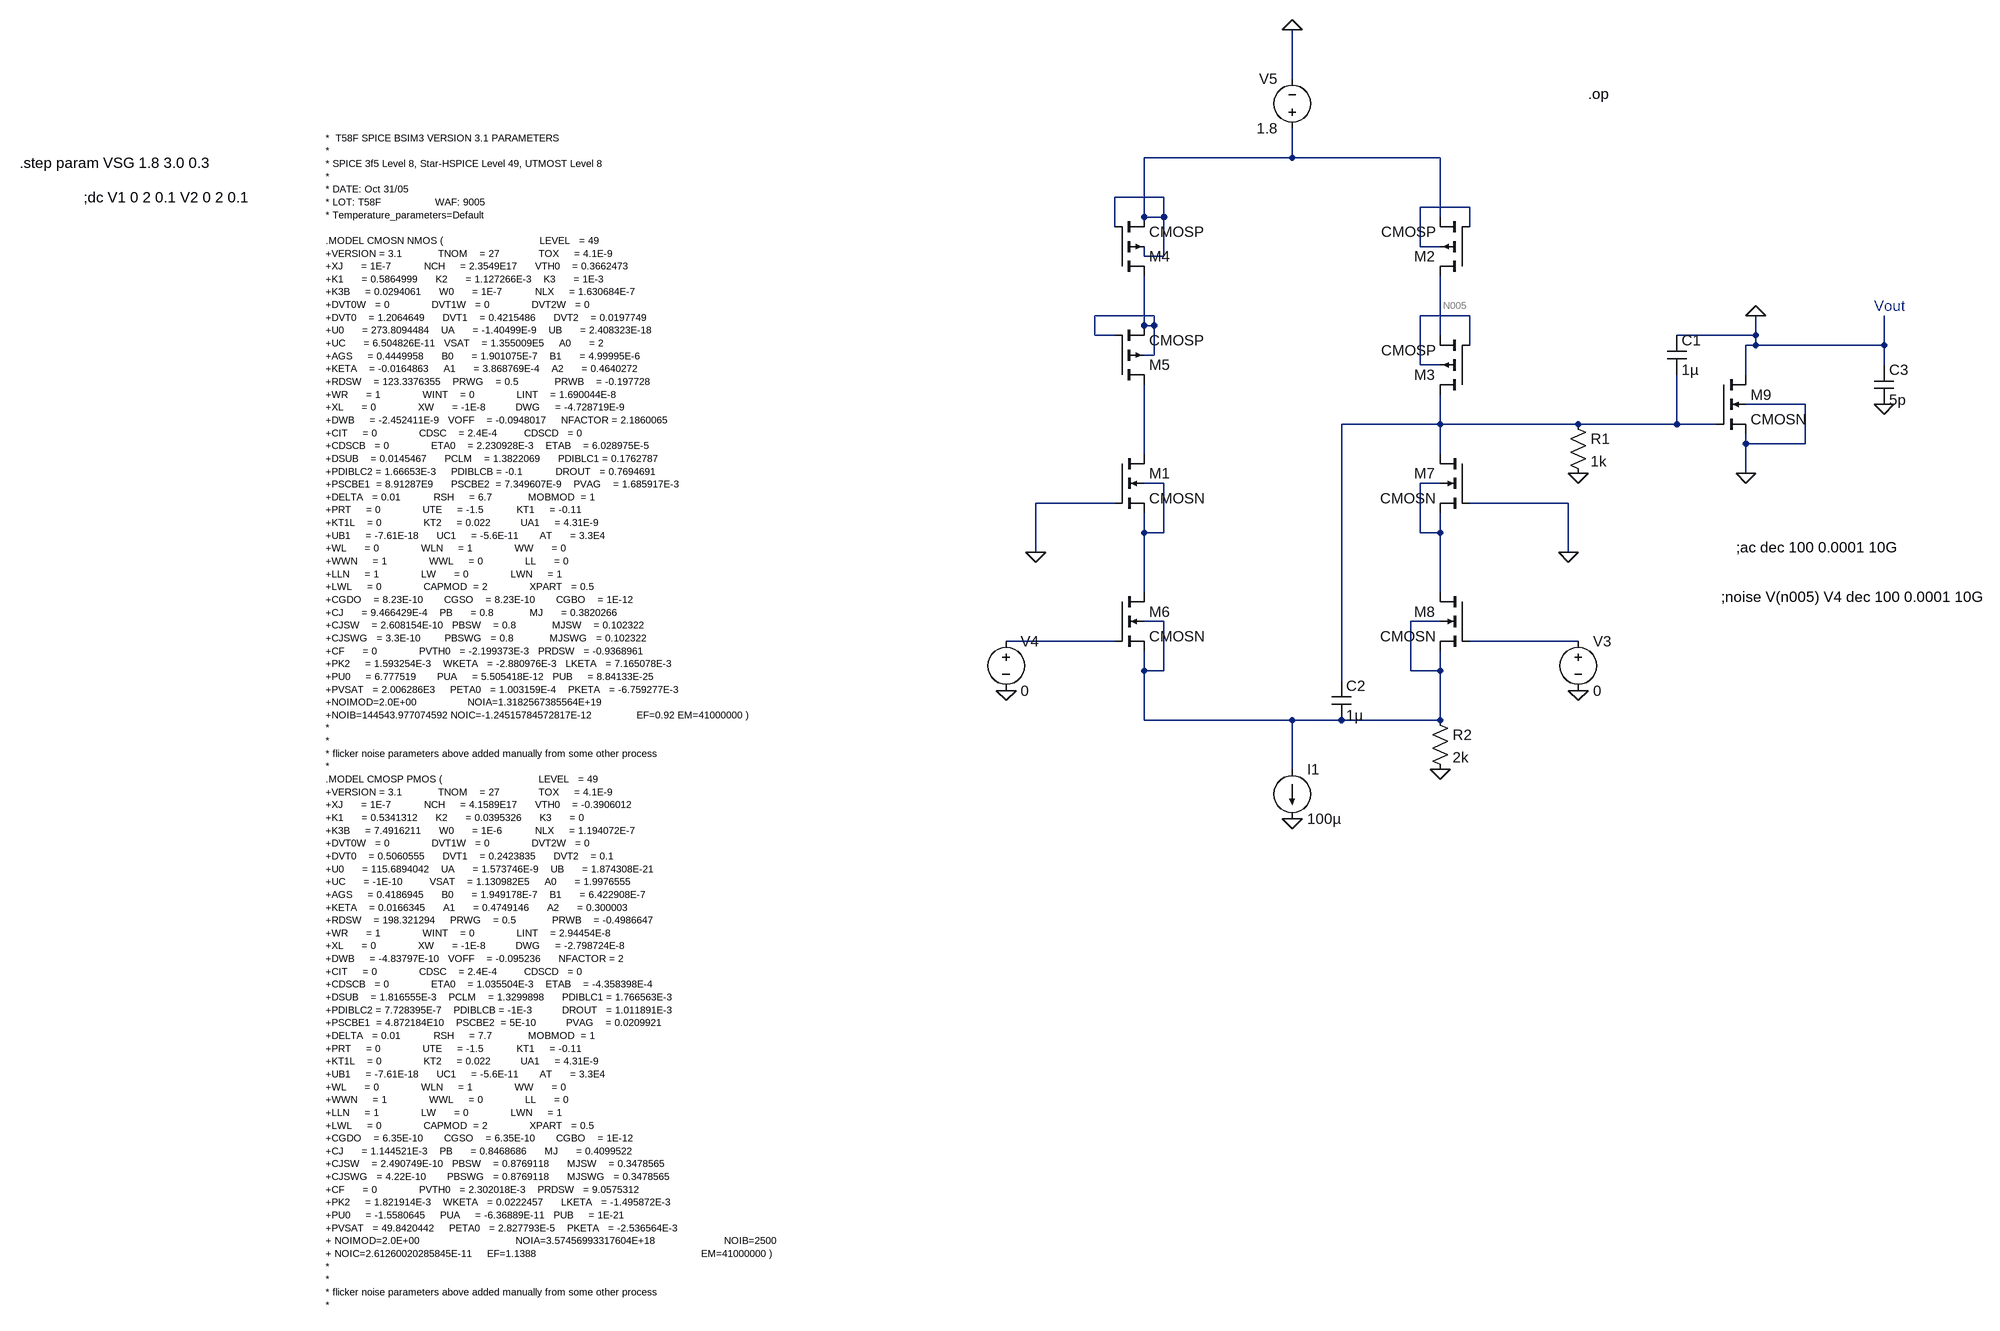
[diagram p0: schematic Project.asc]
Project.asc, the LTspice schematic file:
Version 4
SHEET 1 3716 956
WIRE 2288 -880 2288 -960
WIRE 2288 -752 2288 -800
WIRE 2288 -752 2048 -752
WIRE 2528 -752 2288 -752
WIRE 2080 -688 2000 -688
WIRE 2576 -672 2496 -672
WIRE 2048 -656 2048 -752
WIRE 2080 -656 2080 -688
WIRE 2080 -656 2048 -656
WIRE 2528 -656 2528 -752
WIRE 2000 -640 2000 -688
WIRE 2576 -640 2576 -672
WIRE 2496 -608 2496 -672
WIRE 2528 -608 2496 -608
WIRE 2048 -592 2048 -608
WIRE 2080 -592 2080 -656
WIRE 2080 -592 2048 -592
WIRE 2064 -496 1968 -496
WIRE 2576 -496 2496 -496
WIRE 2048 -480 2048 -560
WIRE 2064 -480 2064 -496
WIRE 2064 -480 2048 -480
WIRE 1968 -464 1968 -496
WIRE 2000 -464 1968 -464
WIRE 2528 -464 2528 -560
WIRE 3040 -464 3040 -496
WIRE 3040 -464 2912 -464
WIRE 2576 -448 2576 -496
WIRE 3040 -448 3040 -464
WIRE 3040 -448 3024 -448
WIRE 3248 -448 3248 -496
WIRE 3248 -448 3040 -448
WIRE 2064 -432 2064 -480
WIRE 2064 -432 2048 -432
WIRE 2496 -416 2496 -496
WIRE 2528 -416 2496 -416
WIRE 3248 -416 3248 -448
WIRE 3024 -400 3024 -448
WIRE 3120 -352 3024 -352
WIRE 2528 -320 2528 -368
WIRE 2528 -320 2368 -320
WIRE 2752 -320 2528 -320
WIRE 2912 -320 2912 -400
WIRE 2912 -320 2752 -320
WIRE 2976 -320 2912 -320
WIRE 3024 -288 3024 -304
WIRE 3120 -288 3120 -352
WIRE 3120 -288 3024 -288
WIRE 2048 -272 2048 -384
WIRE 2528 -272 2528 -320
WIRE 3024 -240 3024 -288
WIRE 2080 -224 2048 -224
WIRE 2528 -224 2496 -224
WIRE 2000 -192 1872 -192
WIRE 2736 -192 2576 -192
WIRE 2048 -144 2048 -176
WIRE 2080 -144 2080 -224
WIRE 2080 -144 2048 -144
WIRE 2496 -144 2496 -224
WIRE 2528 -144 2528 -176
WIRE 2528 -144 2496 -144
WIRE 1872 -112 1872 -192
WIRE 2736 -112 2736 -192
WIRE 2048 -48 2048 -144
WIRE 2528 -48 2528 -144
WIRE 2080 0 2048 0
WIRE 2528 0 2480 0
WIRE 2000 32 1824 32
WIRE 2752 32 2576 32
WIRE 2048 80 2048 48
WIRE 2080 80 2080 0
WIRE 2080 80 2048 80
WIRE 2480 80 2480 0
WIRE 2528 80 2528 48
WIRE 2528 80 2480 80
WIRE 2368 96 2368 -320
WIRE 2048 160 2048 80
WIRE 2288 160 2048 160
WIRE 2368 160 2288 160
WIRE 2528 160 2528 80
WIRE 2528 160 2368 160
WIRE 2288 240 2288 160
FLAG 2288 320 0
FLAG 1872 -112 0
FLAG 2736 -112 0
FLAG 1824 112 0
FLAG 2752 112 0
FLAG 2288 -960 0
FLAG 3024 -240 0
FLAG 3248 -352 0
FLAG 2528 240 0
FLAG 3040 -496 0
FLAG 2752 -240 0
SYMBOL pmos4 2576 -560 R180
SYMATTR InstName M2
SYMATTR Value CMOSP
SYMATTR Value2 l=0.5u w=20u
SYMBOL pmos4 2576 -368 R180
SYMATTR InstName M3
SYMATTR Value CMOSP
SYMATTR Value2 l=0.5u w=20u
SYMBOL pmos4 2000 -560 M180
SYMATTR InstName M4
SYMATTR Value CMOSP
SYMATTR Value2 l=0.5u w=20u
SYMBOL pmos4 2000 -384 M180
SYMATTR InstName M5
SYMATTR Value CMOSP
SYMATTR Value2 l=0.5u w=20u
SYMBOL nmos4 2000 -272 R0
SYMATTR InstName M1
SYMATTR Value CMOSN
SYMATTR Value2 l=0.05u w=20u
SYMBOL nmos4 2000 -48 R0
SYMATTR InstName M6
SYMATTR Value CMOSN
SYMATTR Value2 l=0.05u w=20u
SYMBOL nmos4 2576 -272 M0
SYMATTR InstName M7
SYMATTR Value CMOSN
SYMATTR Value2 l=0.05u w=20u
SYMBOL nmos4 2576 -48 M0
SYMATTR InstName M8
SYMATTR Value CMOSN
SYMATTR Value2 l=0.05u w=20u
SYMBOL current 2288 240 R0
WINDOW 123 0 0 Left 0
WINDOW 39 0 0 Left 0
SYMATTR InstName I1
SYMATTR Value 100µ
SYMBOL voltage 2752 16 R0
WINDOW 39 0 0 Left 0
SYMATTR Value2 AC 0.0001 -180
SYMATTR InstName V3
SYMATTR Value 0
SYMBOL voltage 1824 16 R0
WINDOW 39 0 0 Left 0
SYMATTR Value2 AC 0.0001
SYMATTR InstName V4
SYMATTR Value 0
SYMBOL voltage 2288 -784 R180
WINDOW 0 24 96 Left 2
WINDOW 3 24 16 Left 2
WINDOW 123 0 0 Left 0
WINDOW 39 0 0 Left 0
SYMATTR InstName V5
SYMATTR Value 1.8
SYMBOL nmos4 2976 -400 R0
SYMATTR InstName M9
SYMATTR Value CMOSN
SYMATTR Value2 l=0.05u w=15u
SYMBOL cap 3232 -416 R0
SYMATTR InstName C3
SYMATTR Value 5p
SYMBOL cap 2896 -464 R0
SYMATTR InstName C1
SYMATTR Value 1µ
SYMBOL res 2512 144 R0
SYMATTR InstName R2
SYMATTR Value 2k
SYMBOL res 2736 -336 R0
SYMATTR InstName R1
SYMATTR Value 1k
SYMBOL cap 2352 96 R0
SYMATTR InstName C2
SYMATTR Value 1µ
TEXT 720 -784 Left 1 !*  T58F SPICE BSIM3 VERSION 3.1 PARAMETERS\n* \n* SPICE 3f5 Level 8, Star-HSPICE Level 49, UTMOST Level 8\n* \n* DATE: Oct 31/05\n* LOT: T58F                  WAF: 9005\n* Temperature_parameters=Default\n \n.MODEL CMOSN NMOS (                                LEVEL   = 49\n+VERSION = 3.1            TNOM    = 27             TOX     = 4.1E-9\n+XJ      = 1E-7           NCH     = 2.3549E17      VTH0    = 0.3662473\n+K1      = 0.5864999      K2      = 1.127266E-3    K3      = 1E-3\n+K3B     = 0.0294061      W0      = 1E-7           NLX     = 1.630684E-7\n+DVT0W   = 0              DVT1W   = 0              DVT2W   = 0\n+DVT0    = 1.2064649      DVT1    = 0.4215486      DVT2    = 0.0197749\n+U0      = 273.8094484    UA      = -1.40499E-9    UB      = 2.408323E-18\n+UC      = 6.504826E-11   VSAT    = 1.355009E5     A0      = 2\n+AGS     = 0.4449958      B0      = 1.901075E-7    B1      = 4.99995E-6\n+KETA    = -0.0164863     A1      = 3.868769E-4    A2      = 0.4640272\n+RDSW    = 123.3376355    PRWG    = 0.5            PRWB    = -0.197728\n+WR      = 1              WINT    = 0              LINT    = 1.690044E-8\n+XL      = 0              XW      = -1E-8          DWG     = -4.728719E-9\n+DWB     = -2.452411E-9   VOFF    = -0.0948017     NFACTOR = 2.1860065\n+CIT     = 0              CDSC    = 2.4E-4         CDSCD   = 0\n+CDSCB   = 0              ETA0    = 2.230928E-3    ETAB    = 6.028975E-5\n+DSUB    = 0.0145467      PCLM    = 1.3822069      PDIBLC1 = 0.1762787\n+PDIBLC2 = 1.66653E-3     PDIBLCB = -0.1           DROUT   = 0.7694691\n+PSCBE1  = 8.91287E9      PSCBE2  = 7.349607E-9    PVAG    = 1.685917E-3\n+DELTA   = 0.01           RSH     = 6.7            MOBMOD  = 1\n+PRT     = 0              UTE     = -1.5           KT1     = -0.11\n+KT1L    = 0              KT2     = 0.022          UA1     = 4.31E-9\n+UB1     = -7.61E-18      UC1     = -5.6E-11       AT      = 3.3E4\n+WL      = 0              WLN     = 1              WW      = 0\n+WWN     = 1              WWL     = 0              LL      = 0\n+LLN     = 1              LW      = 0              LWN     = 1\n+LWL     = 0              CAPMOD  = 2              XPART   = 0.5\n+CGDO    = 8.23E-10       CGSO    = 8.23E-10       CGBO    = 1E-12\n+CJ      = 9.466429E-4    PB      = 0.8            MJ      = 0.3820266\n+CJSW    = 2.608154E-10   PBSW    = 0.8            MJSW    = 0.102322\n+CJSWG   = 3.3E-10        PBSWG   = 0.8            MJSWG   = 0.102322\n+CF      = 0              PVTH0   = -2.199373E-3   PRDSW   = -0.9368961\n+PK2     = 1.593254E-3    WKETA   = -2.880976E-3   LKETA   = 7.165078E-3\n+PU0     = 6.777519       PUA     = 5.505418E-12   PUB     = 8.84133E-25\n+PVSAT   = 2.006286E3     PETA0   = 1.003159E-4    PKETA   = -6.759277E-3\n+NOIMOD=2.0E+00                 NOIA=1.3182567385564E+19\n+NOIB=144543.977074592 NOIC=-1.24515784572817E-12               EF=0.92 EM=41000000 )\n*\n*\n* flicker noise parameters above added manually from some other process\n* \n.MODEL CMOSP PMOS (                                LEVEL   = 49\n+VERSION = 3.1            TNOM    = 27             TOX     = 4.1E-9\n+XJ      = 1E-7           NCH     = 4.1589E17      VTH0    = -0.3906012\n+K1      = 0.5341312      K2      = 0.0395326      K3      = 0\n+K3B     = 7.4916211      W0      = 1E-6           NLX     = 1.194072E-7\n+DVT0W   = 0              DVT1W   = 0              DVT2W   = 0\n+DVT0    = 0.5060555      DVT1    = 0.2423835      DVT2    = 0.1\n+U0      = 115.6894042    UA      = 1.573746E-9    UB      = 1.874308E-21\n+UC      = -1E-10         VSAT    = 1.130982E5     A0      = 1.9976555\n+AGS     = 0.4186945      B0      = 1.949178E-7    B1      = 6.422908E-7\n+KETA    = 0.0166345      A1      = 0.4749146      A2      = 0.300003\n+RDSW    = 198.321294     PRWG    = 0.5            PRWB    = -0.4986647\n+WR      = 1              WINT    = 0              LINT    = 2.94454E-8\n+XL      = 0              XW      = -1E-8          DWG     = -2.798724E-8\n+DWB     = -4.83797E-10   VOFF    = -0.095236      NFACTOR = 2\n+CIT     = 0              CDSC    = 2.4E-4         CDSCD   = 0\n+CDSCB   = 0              ETA0    = 1.035504E-3    ETAB    = -4.358398E-4\n+DSUB    = 1.816555E-3    PCLM    = 1.3299898      PDIBLC1 = 1.766563E-3\n+PDIBLC2 = 7.728395E-7    PDIBLCB = -1E-3          DROUT   = 1.011891E-3\n+PSCBE1  = 4.872184E10    PSCBE2  = 5E-10          PVAG    = 0.0209921\n+DELTA   = 0.01           RSH     = 7.7            MOBMOD  = 1\n+PRT     = 0              UTE     = -1.5           KT1     = -0.11\n+KT1L    = 0              KT2     = 0.022          UA1     = 4.31E-9\n+UB1     = -7.61E-18      UC1     = -5.6E-11       AT      = 3.3E4\n+WL      = 0              WLN     = 1              WW      = 0\n+WWN     = 1              WWL     = 0              LL      = 0\n+LLN     = 1              LW      = 0              LWN     = 1\n+LWL     = 0              CAPMOD  = 2              XPART   = 0.5\n+CGDO    = 6.35E-10       CGSO    = 6.35E-10       CGBO    = 1E-12\n+CJ      = 1.144521E-3    PB      = 0.8468686      MJ      = 0.4099522\n+CJSW    = 2.490749E-10   PBSW    = 0.8769118      MJSW    = 0.3478565\n+CJSWG   = 4.22E-10       PBSWG   = 0.8769118      MJSWG   = 0.3478565\n+CF      = 0              PVTH0   = 2.302018E-3    PRDSW   = 9.0575312\n+PK2     = 1.821914E-3    WKETA   = 0.0222457      LKETA   = -1.495872E-3\n+PU0     = -1.5580645     PUA     = -6.36889E-11   PUB     = 1E-21\n+PVSAT   = 49.8420442     PETA0   = 2.827793E-5    PKETA   = -2.536564E-3 \n+ NOIMOD=2.0E+00                                NOIA=3.57456993317604E+18                       NOIB=2500\n+ NOIC=2.61260020285845E-11     EF=1.1388                                                       EM=41000000 )\n*\n*\n* flicker noise parameters above added manually from some other process\n*
TEXT 328 -688 Left 2 !;dc V1 0 2 0.1 V2 0 2 0.1
TEXT 224 -744 Left 2 !.step param VSG 1.8 3.0 0.3
TEXT 2768 -856 Left 2 !.op
TEXT 3008 -120 Left 2 !;ac dec 100 0.0001 10G
TEXT 3232 -512 Left 2 ;Vout
TEXT 2984 -40 Left 2 !;noise V(n005) V4 dec 100 0.0001 10G

The netlist it stands for:
* Project.asc
M2 N005 N002 N001 N002 CMOSP l=0.5u w=20u
M3 N006 N004 N005 N004 CMOSP l=0.5u w=20u
M4 N003 N001 N001 N001 CMOSP l=0.5u w=20u
M5 N007 N003 N003 N003 CMOSP l=0.5u w=20u
M1 N007 0 N008 N008 CMOSN l=0.05u w=20u
M6 N008 N011 N010 N010 CMOSN l=0.05u w=20u
M7 N006 0 N009 N009 CMOSN l=0.05u w=20u
M8 N009 N012 N010 N010 CMOSN l=0.05u w=20u
I1 N010 0 100µ
V3 N012 0 0 AC 0.0001 -180
V4 N011 0 0 AC 0.0001
V5 N001 0 1.8
M9 0 N006 0 0 CMOSN l=0.05u w=15u
C3 0 0 5p
C1 0 N006 1µ
R2 N010 0 2k
R1 N006 0 1k
C2 N006 N010 1µ
.model NMOS NMOS
.model PMOS PMOS
.lib standard.mos
*  T58F SPICE BSIM3 VERSION 3.1 PARAMETERS
*
* SPICE 3f5 Level 8, Star-HSPICE Level 49, UTMOST Level 8
*
* DATE: Oct 31/05
* LOT: T58F                  WAF: 9005
* Temperature_parameters=Default
.MODEL CMOSN NMOS (                                LEVEL   = 49
+VERSION = 3.1            TNOM    = 27             TOX     = 4.1E-9
+XJ      = 1E-7           NCH     = 2.3549E17      VTH0    = 0.3662473
+K1      = 0.5864999      K2      = 1.127266E-3    K3      = 1E-3
+K3B     = 0.0294061      W0      = 1E-7           NLX     = 1.630684E-7
+DVT0W   = 0              DVT1W   = 0              DVT2W   = 0
+DVT0    = 1.2064649      DVT1    = 0.4215486      DVT2    = 0.0197749
+U0      = 273.8094484    UA      = -1.40499E-9    UB      = 2.408323E-18
+UC      = 6.504826E-11   VSAT    = 1.355009E5     A0      = 2
+AGS     = 0.4449958      B0      = 1.901075E-7    B1      = 4.99995E-6
+KETA    = -0.0164863     A1      = 3.868769E-4    A2      = 0.4640272
+RDSW    = 123.3376355    PRWG    = 0.5            PRWB    = -0.197728
+WR      = 1              WINT    = 0              LINT    = 1.690044E-8
+XL      = 0              XW      = -1E-8          DWG     = -4.728719E-9
+DWB     = -2.452411E-9   VOFF    = -0.0948017     NFACTOR = 2.1860065
+CIT     = 0              CDSC    = 2.4E-4         CDSCD   = 0
+CDSCB   = 0              ETA0    = 2.230928E-3    ETAB    = 6.028975E-5
+DSUB    = 0.0145467      PCLM    = 1.3822069      PDIBLC1 = 0.1762787
+PDIBLC2 = 1.66653E-3     PDIBLCB = -0.1           DROUT   = 0.7694691
+PSCBE1  = 8.91287E9      PSCBE2  = 7.349607E-9    PVAG    = 1.685917E-3
+DELTA   = 0.01           RSH     = 6.7            MOBMOD  = 1
+PRT     = 0              UTE     = -1.5           KT1     = -0.11
+KT1L    = 0              KT2     = 0.022          UA1     = 4.31E-9
+UB1     = -7.61E-18      UC1     = -5.6E-11       AT      = 3.3E4
+WL      = 0              WLN     = 1              WW      = 0
+WWN     = 1              WWL     = 0              LL      = 0
+LLN     = 1              LW      = 0              LWN     = 1
+LWL     = 0              CAPMOD  = 2              XPART   = 0.5
+CGDO    = 8.23E-10       CGSO    = 8.23E-10       CGBO    = 1E-12
+CJ      = 9.466429E-4    PB      = 0.8            MJ      = 0.3820266
+CJSW    = 2.608154E-10   PBSW    = 0.8            MJSW    = 0.102322
+CJSWG   = 3.3E-10        PBSWG   = 0.8            MJSWG   = 0.102322
+CF      = 0              PVTH0   = -2.199373E-3   PRDSW   = -0.9368961
+PK2     = 1.593254E-3    WKETA   = -2.880976E-3   LKETA   = 7.165078E-3
+PU0     = 6.777519       PUA     = 5.505418E-12   PUB     = 8.84133E-25
+PVSAT   = 2.006286E3     PETA0   = 1.003159E-4    PKETA   = -6.759277E-3
+NOIMOD=2.0E+00                 NOIA=1.3182567385564E+19
+NOIB=144543.977074592 NOIC=-1.24515784572817E-12               EF=0.92 EM=41000000 )
*
*
* flicker noise parameters above added manually from some other process
*
.MODEL CMOSP PMOS (                                LEVEL   = 49
+VERSION = 3.1            TNOM    = 27             TOX     = 4.1E-9
+XJ      = 1E-7           NCH     = 4.1589E17      VTH0    = -0.3906012
+K1      = 0.5341312      K2      = 0.0395326      K3      = 0
+K3B     = 7.4916211      W0      = 1E-6           NLX     = 1.194072E-7
+DVT0W   = 0              DVT1W   = 0              DVT2W   = 0
+DVT0    = 0.5060555      DVT1    = 0.2423835      DVT2    = 0.1
+U0      = 115.6894042    UA      = 1.573746E-9    UB      = 1.874308E-21
+UC      = -1E-10         VSAT    = 1.130982E5     A0      = 1.9976555
+AGS     = 0.4186945      B0      = 1.949178E-7    B1      = 6.422908E-7
+KETA    = 0.0166345      A1      = 0.4749146      A2      = 0.300003
+RDSW    = 198.321294     PRWG    = 0.5            PRWB    = -0.4986647
+WR      = 1              WINT    = 0              LINT    = 2.94454E-8
+XL      = 0              XW      = -1E-8          DWG     = -2.798724E-8
+DWB     = -4.83797E-10   VOFF    = -0.095236      NFACTOR = 2
+CIT     = 0              CDSC    = 2.4E-4         CDSCD   = 0
+CDSCB   = 0              ETA0    = 1.035504E-3    ETAB    = -4.358398E-4
+DSUB    = 1.816555E-3    PCLM    = 1.3299898      PDIBLC1 = 1.766563E-3
+PDIBLC2 = 7.728395E-7    PDIBLCB = -1E-3          DROUT   = 1.011891E-3
+PSCBE1  = 4.872184E10    PSCBE2  = 5E-10          PVAG    = 0.0209921
+DELTA   = 0.01           RSH     = 7.7            MOBMOD  = 1
+PRT     = 0              UTE     = -1.5           KT1     = -0.11
+KT1L    = 0              KT2     = 0.022          UA1     = 4.31E-9
+UB1     = -7.61E-18      UC1     = -5.6E-11       AT      = 3.3E4
+WL      = 0              WLN     = 1              WW      = 0
+WWN     = 1              WWL     = 0              LL      = 0
+LLN     = 1              LW      = 0              LWN     = 1
+LWL     = 0              CAPMOD  = 2              XPART   = 0.5
+CGDO    = 6.35E-10       CGSO    = 6.35E-10       CGBO    = 1E-12
+CJ      = 1.144521E-3    PB      = 0.8468686      MJ      = 0.4099522
+CJSW    = 2.490749E-10   PBSW    = 0.8769118      MJSW    = 0.3478565
+CJSWG   = 4.22E-10       PBSWG   = 0.8769118      MJSWG   = 0.3478565
+CF      = 0              PVTH0   = 2.302018E-3    PRDSW   = 9.0575312
+PK2     = 1.821914E-3    WKETA   = 0.0222457      LKETA   = -1.495872E-3
+PU0     = -1.5580645     PUA     = -6.36889E-11   PUB     = 1E-21
+PVSAT   = 49.8420442     PETA0   = 2.827793E-5    PKETA   = -2.536564E-3
+ NOIMOD=2.0E+00                                NOIA=3.57456993317604E+18                       NOIB=2500
+ NOIC=2.61260020285845E-11     EF=1.1388                                                       EM=41000000 )
*
*
* flicker noise parameters above added manually from some other process
*
;dc V1 0 2 0.1 V2 0 2 0.1
.step param VSG 1.8 3.0 0.3
.op
;ac dec 100 0.0001 10G
* Vout
;noise V(n005) V4 dec 100 0.0001 10G
.backanno
.end

* Results of the author's LTspice run, read from the files saved beside the schematic
* From the log:
*   Semiconductor Device Operating Points:
*                           --- BSIM3 MOSFETS ---
*   Name:        m2          m3          m4          m5          m1
*   Model:      cmosp       cmosp       cmosp       cmosp       cmosn
*   Id:       -5.39e-09   -5.39e-09   -1.03e-12   -1.03e-12    1.03e-12
*   Vgs:      -1.38e-01   -1.35e-01    0.00e+00    0.00e+00   -7.83e-01
*   Vds:      -6.75e-01   -1.13e+00   -6.24e-04   -6.24e-04    1.02e+00
*   Vbs:      -1.38e-01   -1.35e-01    0.00e+00    0.00e+00    0.00e+00
*   Vth:      -4.01e-01   -4.00e-01   -4.43e-01   -4.43e-01    1.15e+00
*   Vdsat:    -3.50e-02   -3.50e-02   -3.58e-02   -3.58e-02    2.72e-02
*   Gm:        1.35e-07    1.35e-07    2.68e-11    2.68e-11    4.42e-24
*   Gds:       1.15e-09    1.07e-09    1.63e-09    1.63e-09    1.67e-25
*   Gmb        4.15e-08    4.16e-08    1.03e-11    1.03e-11    2.61e-24
*   Cbd:       0.00e+00    0.00e+00    0.00e+00    0.00e+00    0.00e+00
*   Cbs:       0.00e+00    0.00e+00    0.00e+00    0.00e+00    0.00e+00
*   Cgsov:     1.27e-14    1.27e-14    1.27e-14    1.27e-14    1.65e-14
*   Cgdov:     1.27e-14    1.27e-14    1.27e-14    1.27e-14    1.65e-14
*   Cgbov:     4.41e-19    4.41e-19    4.41e-19    4.41e-19    1.62e-20
*   dQgdVgb:   4.58e-14    4.58e-14    4.59e-14    4.59e-14    3.56e-14
*   dQgdVdb:  -1.27e-14   -1.27e-14   -1.27e-14   -1.27e-14   -1.65e-14
*   dQgdVsb:  -1.79e-14   -1.78e-14   -1.27e-14   -1.27e-14   -1.65e-14
*   dQddVgb:  -1.27e-14   -1.27e-14   -1.27e-14   -1.27e-14   -1.65e-14
*   dQddVdb:   1.27e-14    1.27e-14    1.27e-14    1.27e-14    1.65e-14
*   dQddVsb:   3.95e-17    3.71e-17    1.62e-19    1.62e-19   -9.37e-33
*   dQbdVgb:  -2.03e-14   -2.03e-14   -2.05e-14   -2.05e-14   -2.73e-15
*   dQbdVdb:   1.97e-20    2.05e-20   -2.90e-19   -2.90e-19    0.00e+00
*   dQbdVsb:   5.09e-15    5.01e-15    7.42e-19    7.42e-19    9.10e-20
*   Name:        m6          m7          m8          m9
*   Model:      cmosn       cmosn       cmosn       cmosn
*   Id:        1.03e-12    1.13e-13    1.13e-13    0.00e+00
*   Vgs:       2.00e-01    1.03e-01    2.00e-01    5.38e-06
*   Vds:       9.83e-01    1.03e-01    9.74e-02    0.00e+00
*   Vbs:       0.00e+00    0.00e+00    0.00e+00    0.00e+00
*   Vth:       1.15e+00    1.16e+00    1.16e+00    1.16e+00
*   Vdsat:     2.72e-02    2.72e-02    2.72e-02    2.71e-02
*   Gm:        8.44e-13    1.19e-14    1.52e-13    0.00e+00
*   Gds:       3.26e-14    2.70e-15    3.62e-14    5.33e-16
*   Gmb        3.72e-13    5.47e-15    6.73e-14    0.00e+00
*   Cbd:       0.00e+00    0.00e+00    0.00e+00    0.00e+00
*   Cbs:       0.00e+00    0.00e+00    0.00e+00    0.00e+00
*   Cgsov:     1.65e-14    1.65e-14    1.65e-14    1.23e-14
*   Cgdov:     1.65e-14    1.65e-14    1.65e-14    1.23e-14
*   Cgbov:     1.62e-20    1.62e-20    1.62e-20    1.62e-20
*   dQgdVgb:   3.40e-14    3.42e-14    3.40e-14    2.58e-14
*   dQgdVdb:  -1.65e-14   -1.65e-14   -1.65e-14   -1.23e-14
*   dQgdVsb:  -1.65e-14   -1.65e-14   -1.65e-14   -1.23e-14
*   dQddVgb:  -1.65e-14   -1.65e-14   -1.65e-14   -1.23e-14
*   dQddVdb:   1.65e-14    1.65e-14    1.65e-14    1.23e-14
*   dQddVsb:   1.62e-26    1.06e-27    1.38e-26    2.97e-29
*   dQbdVgb:  -1.12e-15   -1.25e-15   -1.12e-15   -1.07e-15
*   dQbdVdb:   3.60e-29   -1.10e-29   -1.77e-28   -7.91e-29
*   dQbdVsb:   3.74e-20    4.16e-20    3.74e-20    3.58e-20